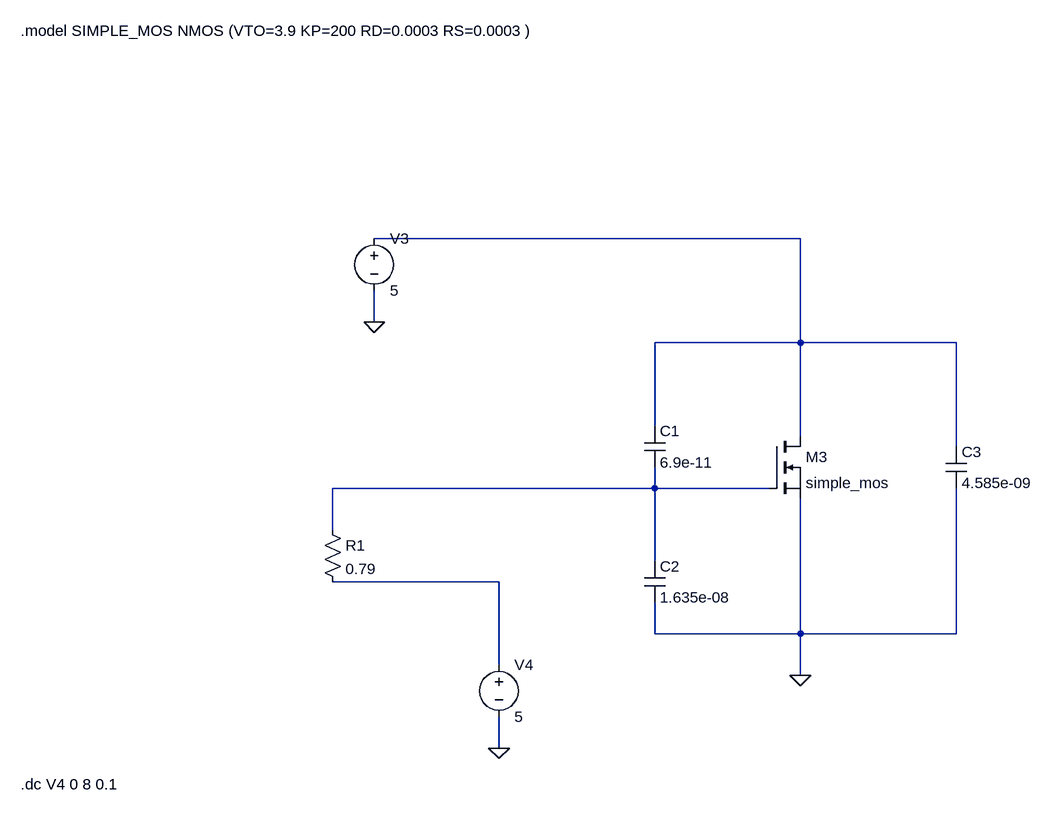
[diagram p0: schematic Draft5.asc]
Draft5.asc, the LTspice schematic file:
Version 4.1
SHEET 1 1504 820
WIRE 848 -208 192 -208
WIRE 192 -80 192 -128
WIRE 848 -48 848 -208
WIRE 848 -48 624 -48
WIRE 1088 -48 848 -48
WIRE 624 80 624 -48
WIRE 848 96 848 -48
WIRE 1088 112 1088 -48
WIRE 624 176 624 144
WIRE 624 176 128 176
WIRE 800 176 624 176
WIRE 128 240 128 176
WIRE 624 288 624 176
WIRE 384 320 128 320
WIRE 624 400 624 352
WIRE 848 400 848 192
WIRE 848 400 624 400
WIRE 1088 400 1088 176
WIRE 1088 400 848 400
WIRE 384 448 384 320
WIRE 848 464 848 400
WIRE 384 576 384 528
FLAG 384 576 0
FLAG 192 -80 0
FLAG 848 464 0
SYMBOL voltage 192 -224 R0
WINDOW 123 0 0 Left 0
WINDOW 39 0 0 Left 0
SYMATTR InstName V3
SYMATTR Value 5
SYMBOL voltage 384 432 R0
WINDOW 123 0 0 Left 0
WINDOW 39 0 0 Left 0
SYMATTR InstName V4
SYMATTR Value 5
SYMBOL cap 608 80 R0
SYMATTR InstName C1
SYMATTR Value 6.9e-11
SYMBOL cap 608 288 R0
SYMATTR InstName C2
SYMATTR Value 1.635e-08
SYMBOL cap 1072 112 R0
SYMATTR InstName C3
SYMATTR Value 4.585e-09
SYMBOL nmos 800 96 R0
SYMATTR InstName M3
SYMATTR Value simple_mos
SYMBOL res 112 224 R0
SYMATTR InstName R1
SYMATTR Value 0.79
TEXT -352 -528 Left 2 !.model SIMPLE_MOS NMOS (VTO=3.9 KP=200 RD=0.0003 RS=0.0003 )
TEXT -352 632 Left 2 !.dc V4 0 8 0.1

The netlist it stands for:
* Draft5.asc
V3 N001 0 5
V4 N003 0 5
C1 N001 N002 6.9e-11
C2 N002 0 1.635e-08
C3 N001 0 4.585e-09
M3 N001 N002 0 0 simple_mos
R1 N002 N003 0.79
.model NMOS NMOS
.model PMOS PMOS
.lib standard.mos
.model SIMPLE_MOS NMOS (VTO=3.9 KP=200 RD=0.0003 RS=0.0003 )
.dc V4 0 8 0.1
.backanno
.end